# Altium schematic sheet [0X] - CPU POWER.SchDoc
size 817 x 513 mm
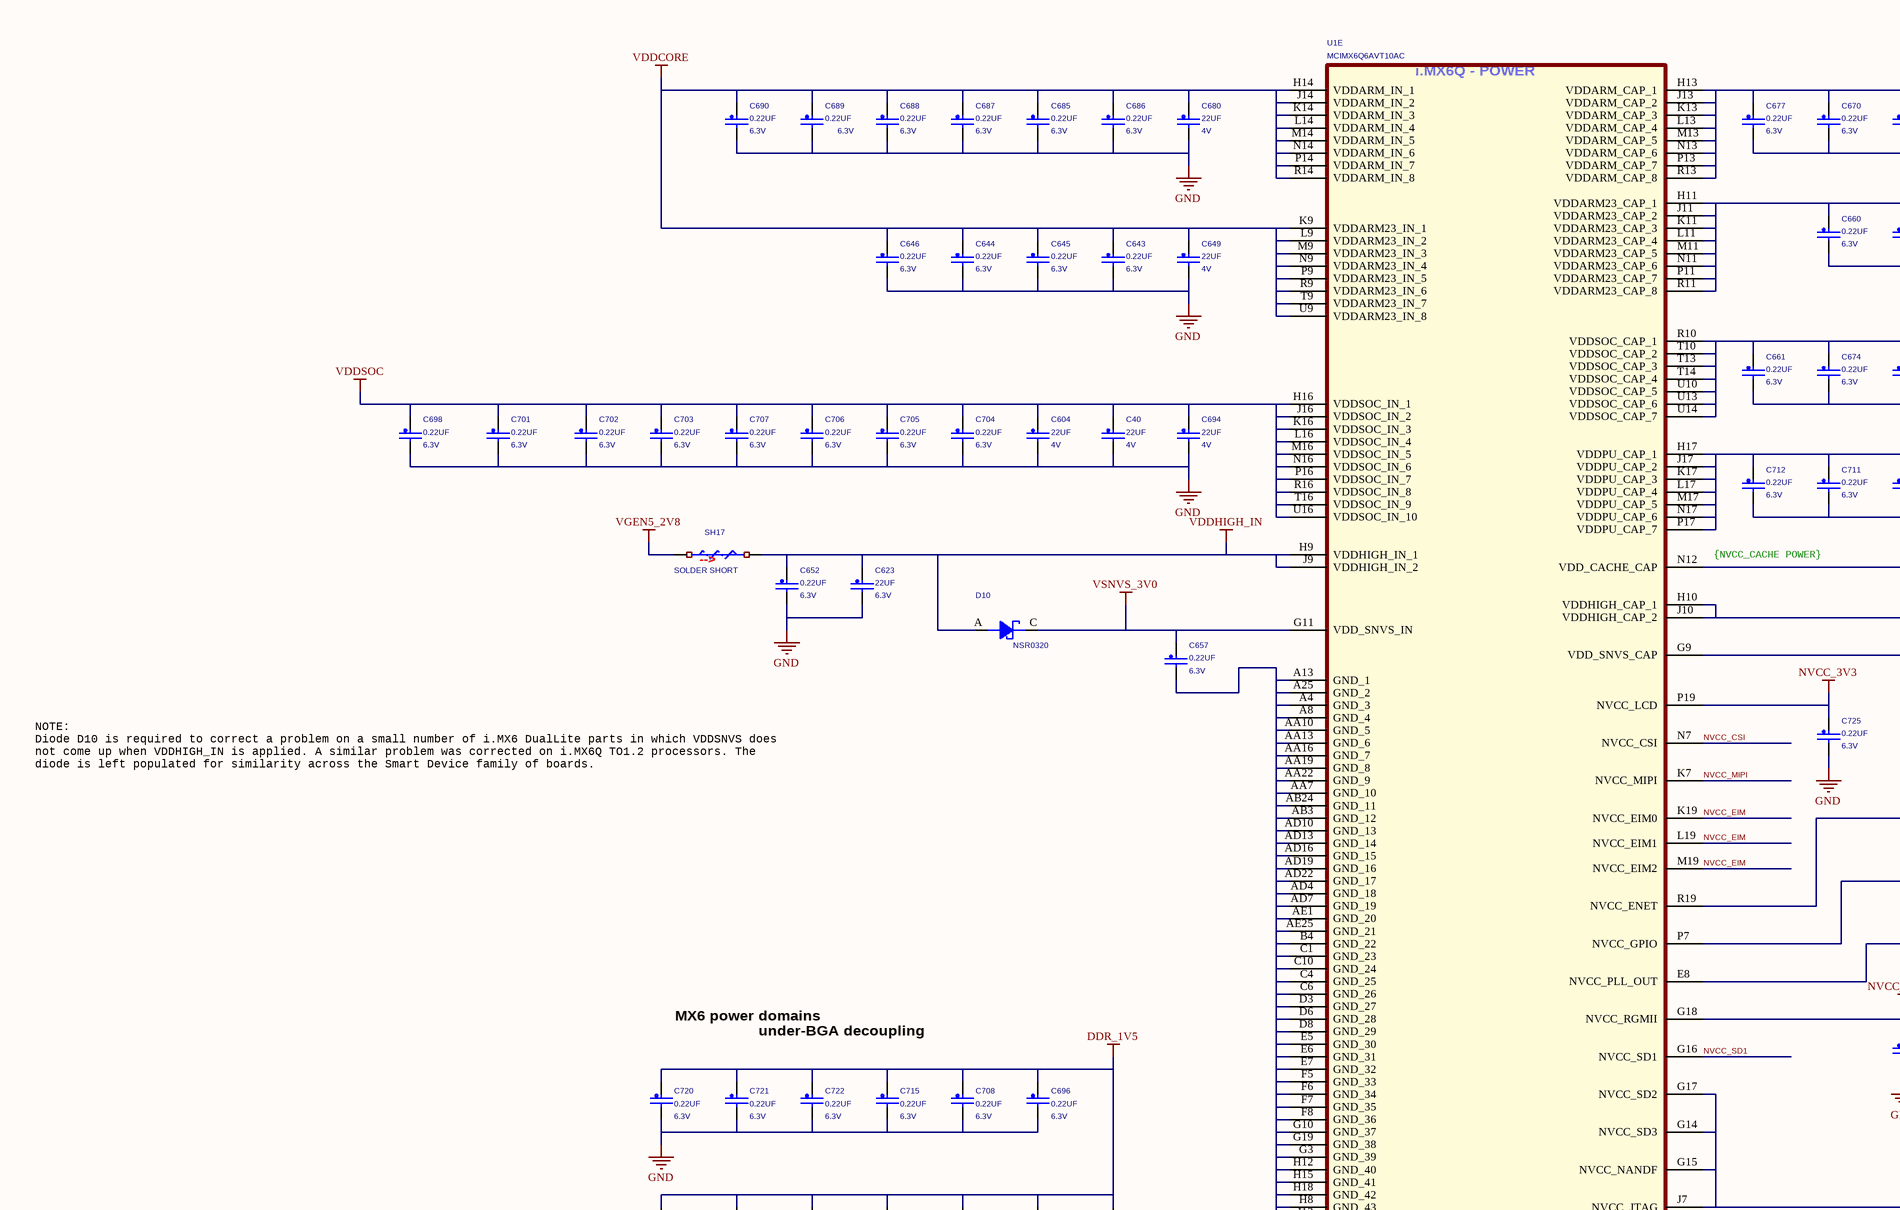
[diagram p0: [0X] - CPU POWER.SchDoc, top left]
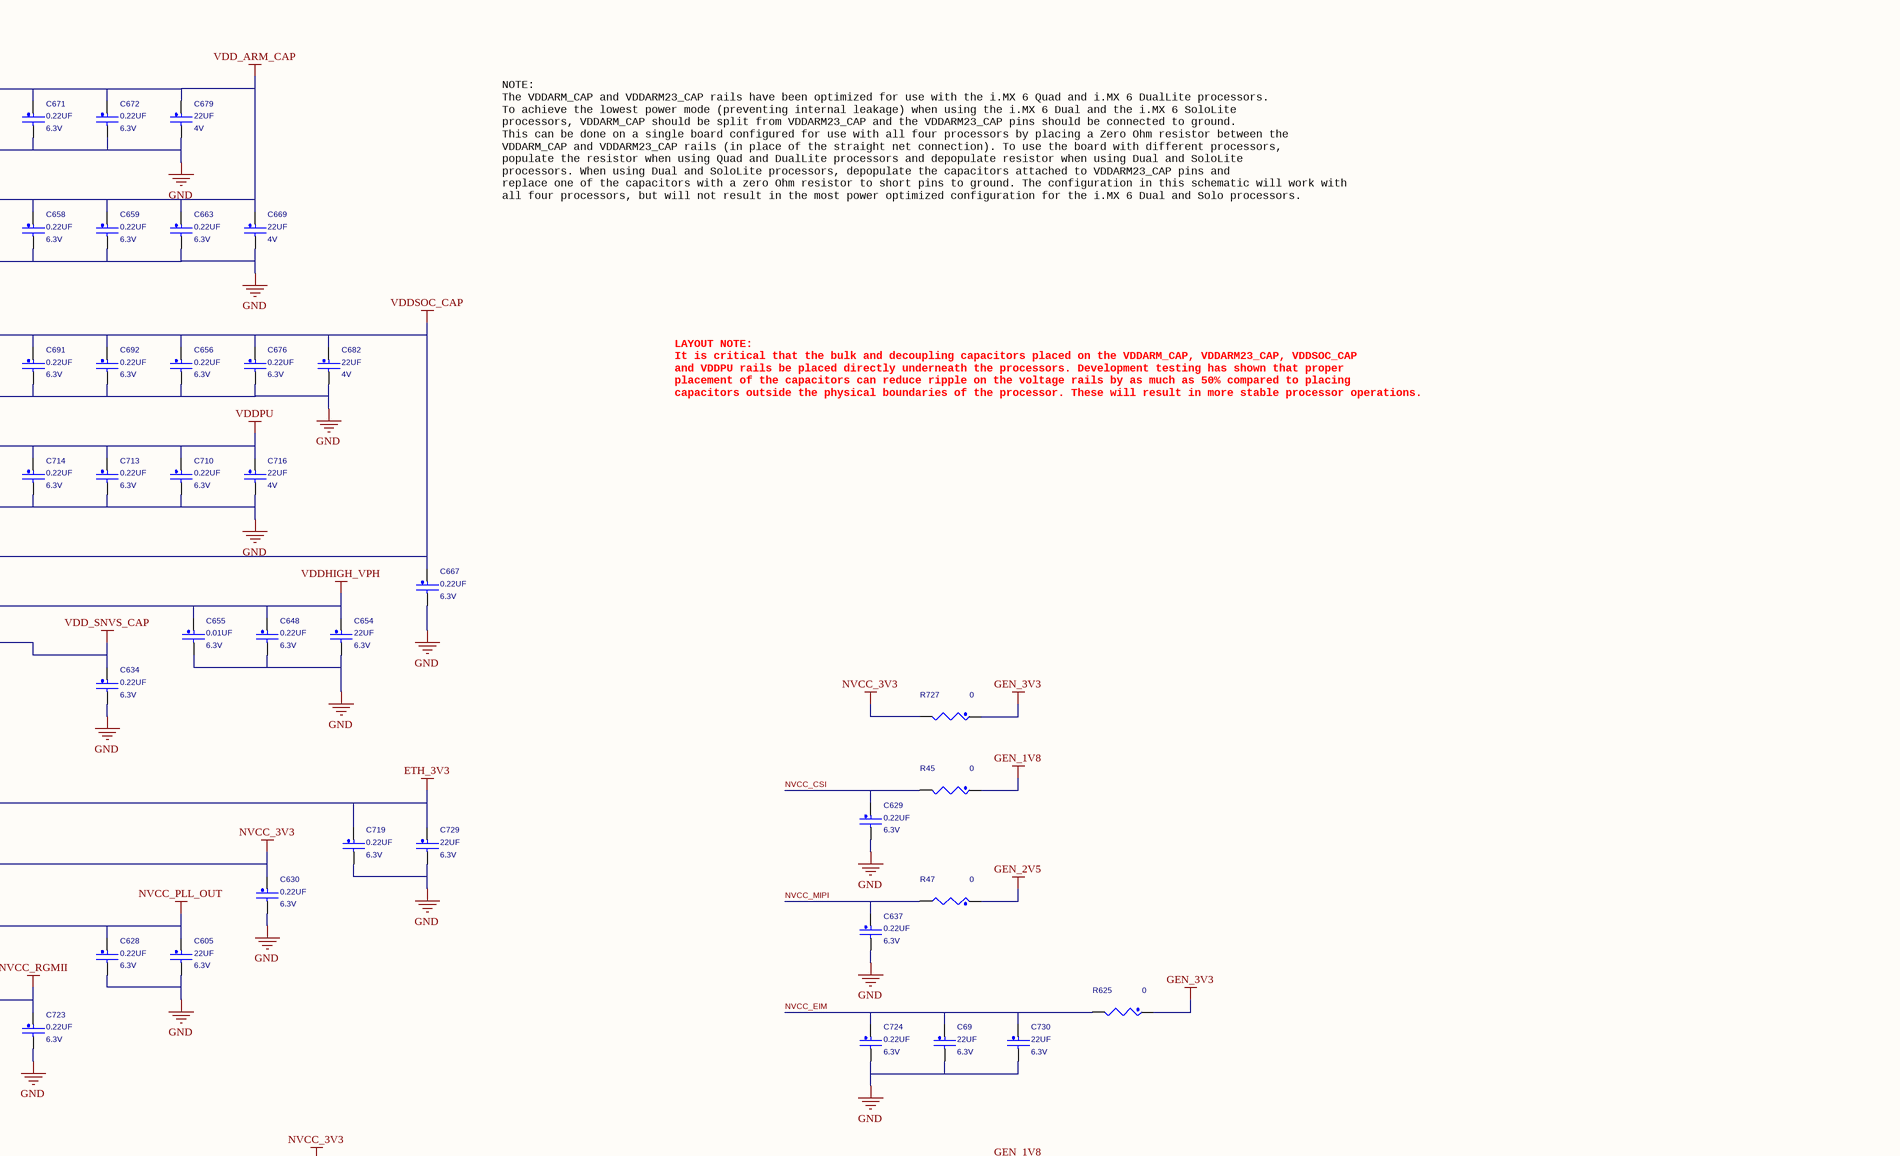
[diagram p1: [0X] - CPU POWER.SchDoc, top middle]
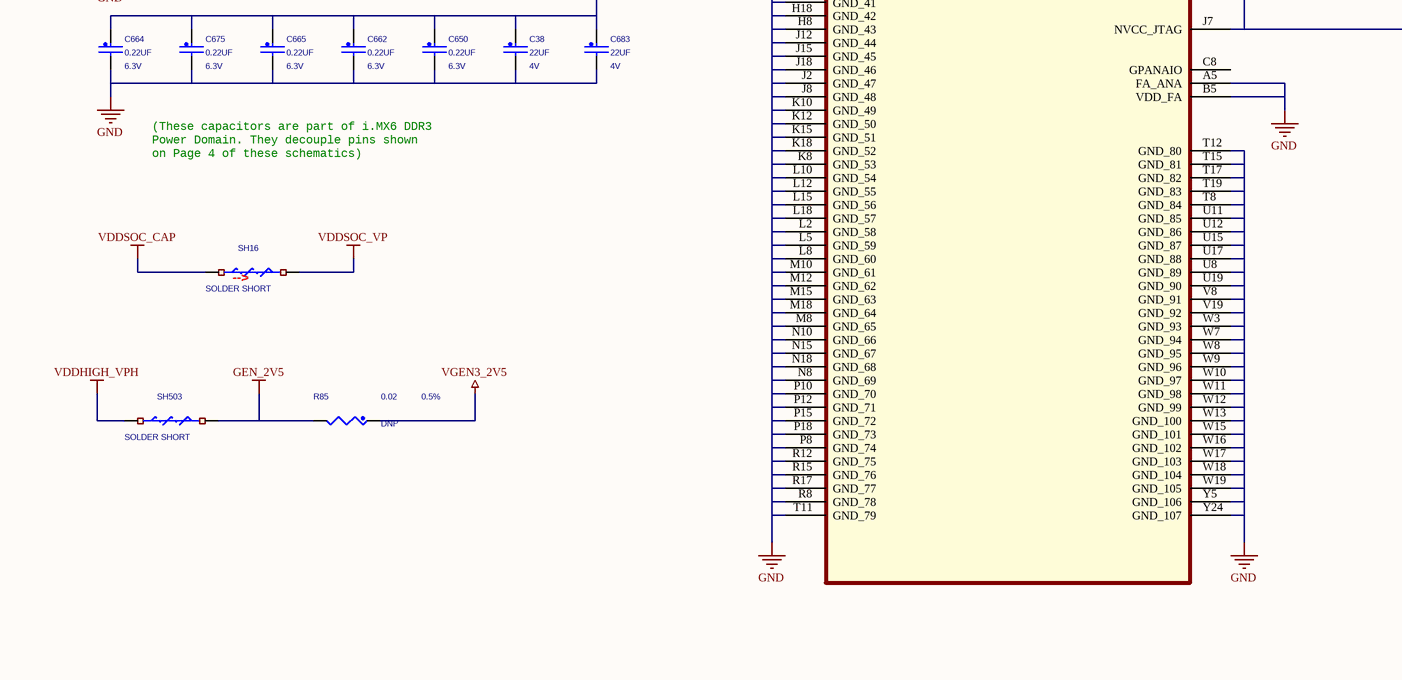
[diagram p2: [0X] - CPU POWER.SchDoc, bottom left]
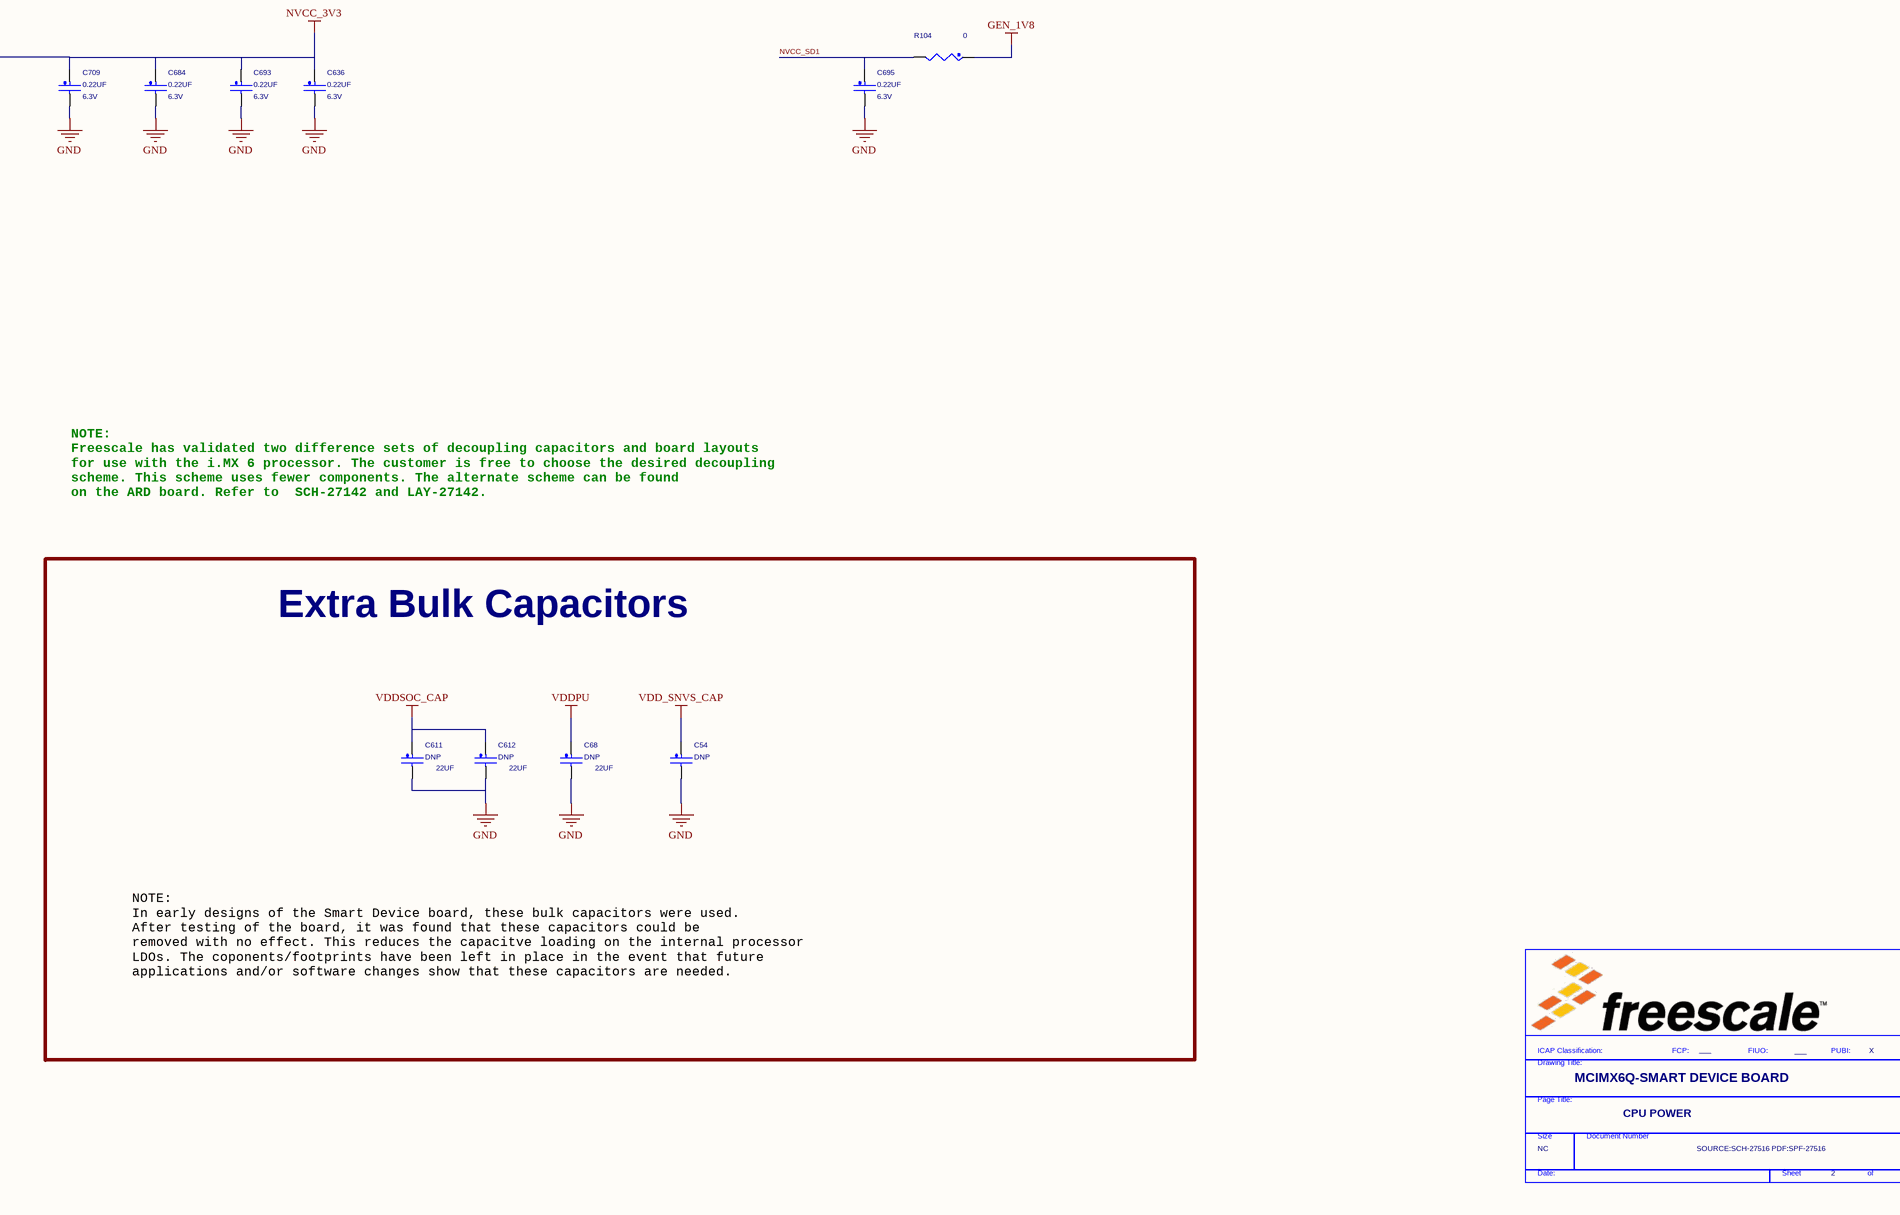
[diagram p3: [0X] - CPU POWER.SchDoc, bottom middle]
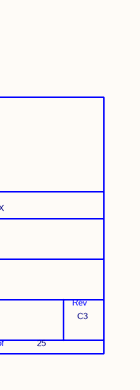
[diagram p4: [0X] - CPU POWER.SchDoc, bottom right]

## Parts
*  FIUO: ___  PUBI: X  Doc: SOURCE:SCH-27516 PDF:SPF-27516  RevCode: C3  Title: MCIMX6Q-SMART DEVICE BOARD  Page Size: NC  Page Number: 2  Page Count: 25  PageTitle: CPU POWER  (hidden comment: TitleBlock_FS)  (graphical)
C38  22UF  WVDC: 4V  [0603_CC]
C40  22UF  WVDC: 4V  [0603_CC]
C54  ASSY_OPT: DNP  [0603_CC]  (hidden comment: 22UF)
C68  22UF  ASSY_OPT: DNP  [0603_CC]
C69  22UF  WVDC: 6.3V  [0603_CC]
C604  22UF  WVDC: 4V  [0603_CC]
C605  22UF  WVDC: 6.3V  [0603_CC]
C611  22UF  ASSY_OPT: DNP  [0603_CC]
C612  22UF  ASSY_OPT: DNP  [0603_CC]
C623  22UF  WVDC: 6.3V  [0603_CC]
C628  0.22UF  WVDC: 6.3V  [0201_CC]
C629  0.22UF  WVDC: 6.3V  [0201_CC]
C630  0.22UF  WVDC: 6.3V  [0201_CC]
C634  0.22UF  WVDC: 6.3V  [0201_CC]
C636  0.22UF  WVDC: 6.3V  [0201_CC]
C637  0.22UF  WVDC: 6.3V  [0201_CC]
C643  0.22UF  WVDC: 6.3V  [0201_CC]
C644  0.22UF  WVDC: 6.3V  [0201_CC]
C645  0.22UF  WVDC: 6.3V  [0201_CC]
C646  0.22UF  WVDC: 6.3V  [0201_CC]
C648  0.22UF  WVDC: 6.3V  [0201_CC]
C649  22UF  WVDC: 4V  [0603_CC]
C650  0.22UF  WVDC: 6.3V  [0201_CC]
C652  0.22UF  WVDC: 6.3V  [0201_CC]
C654  22UF  WVDC: 6.3V  [0603_CC]
C655  0.01UF  WVDC: 6.3V  [0201_CC]
C656  0.22UF  WVDC: 6.3V  [0201_CC]
C657  0.22UF  WVDC: 6.3V  [0201_CC]
C658  0.22UF  WVDC: 6.3V  [0201_CC]
C659  0.22UF  WVDC: 6.3V  [0201_CC]
C660  0.22UF  WVDC: 6.3V  [0201_CC]
C661  0.22UF  WVDC: 6.3V  [0201_CC]
C662  0.22UF  WVDC: 6.3V  [0201_CC]
C663  0.22UF  WVDC: 6.3V  [0201_CC]
C664  0.22UF  WVDC: 6.3V  [0201_CC]
C665  0.22UF  WVDC: 6.3V  [0201_CC]
C667  0.22UF  WVDC: 6.3V  [0201_CC]
C669  22UF  WVDC: 4V  [0603_CC]
C670  0.22UF  WVDC: 6.3V  [0201_CC]
C671  0.22UF  WVDC: 6.3V  [0201_CC]
C672  0.22UF  WVDC: 6.3V  [0201_CC]
C674  0.22UF  WVDC: 6.3V  [0201_CC]
C675  0.22UF  WVDC: 6.3V  [0201_CC]
C676  0.22UF  WVDC: 6.3V  [0201_CC]
C677  0.22UF  WVDC: 6.3V  [0201_CC]
C679  22UF  WVDC: 4V  [0603_CC]
C680  22UF  WVDC: 4V  [0603_CC]
C682  22UF  WVDC: 4V  [0603_CC]
C683  22UF  WVDC: 4V  [0603_CC]
C684  0.22UF  WVDC: 6.3V  [0201_CC]
C685  0.22UF  WVDC: 6.3V  [0201_CC]
C686  0.22UF  WVDC: 6.3V  [0201_CC]
C687  0.22UF  WVDC: 6.3V  [0201_CC]
C688  0.22UF  WVDC: 6.3V  [0201_CC]
C689  0.22UF  WVDC: 6.3V  [0201_CC]
C690  0.22UF  WVDC: 6.3V  [0201_CC]
C691  0.22UF  WVDC: 6.3V  [0201_CC]
C692  0.22UF  WVDC: 6.3V  [0201_CC]
C693  0.22UF  WVDC: 6.3V  [0201_CC]
C694  22UF  WVDC: 4V  [0603_CC]
C695  0.22UF  WVDC: 6.3V  [0201_CC]
C696  0.22UF  WVDC: 6.3V  [0201_CC]
C698  0.22UF  WVDC: 6.3V  [0201_CC]
C701  0.22UF  WVDC: 6.3V  [0201_CC]
C702  0.22UF  WVDC: 6.3V  [0201_CC]
C703  0.22UF  WVDC: 6.3V  [0201_CC]
C704  0.22UF  WVDC: 6.3V  [0201_CC]
C705  0.22UF  WVDC: 6.3V  [0201_CC]
C706  0.22UF  WVDC: 6.3V  [0201_CC]
C707  0.22UF  WVDC: 6.3V  [0201_CC]
C708  0.22UF  WVDC: 6.3V  [0201_CC]
C709  0.22UF  WVDC: 6.3V  [0201_CC]
C710  0.22UF  WVDC: 6.3V  [0201_CC]
C711  0.22UF  WVDC: 6.3V  [0201_CC]
C712  0.22UF  WVDC: 6.3V  [0201_CC]
C713  0.22UF  WVDC: 6.3V  [0201_CC]
C714  0.22UF  WVDC: 6.3V  [0201_CC]
C715  0.22UF  WVDC: 6.3V  [0201_CC]
C716  22UF  WVDC: 4V  [0603_CC]
C719  0.22UF  WVDC: 6.3V  [0201_CC]
C720  0.22UF  WVDC: 6.3V  [0201_CC]
C721  0.22UF  WVDC: 6.3V  [0201_CC]
C722  0.22UF  WVDC: 6.3V  [0201_CC]
C723  0.22UF  WVDC: 6.3V  [0201_CC]
C724  0.22UF  WVDC: 6.3V  [0201_CC]
C725  0.22UF  WVDC: 6.3V  [0201_CC]
C729  22UF  WVDC: 6.3V  [0603_CC]
C730  22UF  WVDC: 6.3V  [0603_CC]
D10  NSR0320  [SOD323]
R45  0  [0402_CC]
R47  0  [0402_CC]
R85  0.02  Tolerance: 0.5%  ASSY_OPT: DNP  [0805_CC]
R104  0  [0402_CC]
R625  0  [0402_CC]
R727  0  [0402_CC]
SH16  SOLDER SHORT  [SH0805_40]
SH17  SOLDER SHORT  [SH0805_40]
SH503  SOLDER SHORT  [SH0805_40]
U1  MCIMX6Q6AVT10AC  [BGA624_0P8_21X21]  (part E of 12)

## Blocks framed on the sheet
Extra Bulk Capacitors: C54 C68 C611 C612

## Nets
DDR_1V5: C38.1 C650.1 C662.1 C664.1 C665.1 C675.1 C683.1 C696.1 C708.1 C715.1 C720.1 C721.1 C722.1
ETH_3V3: C719.1 C729.1 U1.R19(NVCC_ENET)
GEN_1V8: R45.1 R104.1
GEN_2V5: R47.1 R85.2 SH503.2
GEN_3V3: R625.1 R727.1
GND: C38.2 C40.2 C54.2 C68.2 C69.2 C604.2 C605.2 C611.2 C612.2 C623.2 C628.2 C629.2 C630.2 C634.2 C636.2 C637.2 C643.2 C644.2 C645.2 C646.2 C648.2 C649.2 C650.2 C652.2 C654.2 C655.2 C656.2 C657.2 C658.2 C659.2 C660.2 C661.2 C662.2 C663.2 C664.2 C665.2 C667.2 C669.2 C670.2 C671.2 C672.2 C674.2 C675.2 C676.2 C677.2 C679.2 C680.2 C682.2 C683.2 C684.2 C685.2 C686.2 C687.2 C688.2 C689.2 C690.2 C691.2 C692.2 C693.2 C694.2 C695.2 C696.2 C698.2 C701.2 C702.2 C703.2 C704.2 C705.2 C706.2 C707.2 C708.2 C709.2 C710.2 C711.2 C712.2 C713.2 C714.2 C715.2 C716.2 C719.2 C720.2 C721.2 C722.2 C723.2 C724.2 C725.2 C729.2 C730.2 U1.A4(GND_3) U1.A5(FA_ANA) U1.A8(GND_4) U1.A13(GND_1) U1.A25(GND_2) U1.AA7(GND_10) U1.AA10(GND_5) U1.AA13(GND_6) U1.AA16(GND_7) U1.AA19(GND_8) U1.AA22(GND_9) U1.AB3(GND_12) U1.AB24(GND_11) U1.AD4(GND_18) U1.AD7(GND_19) U1.AD10(GND_13) U1.AD13(GND_14) U1.AD16(GND_15) U1.AD19(GND_16) U1.AD22(GND_17) U1.AE1(GND_20) U1.AE25(GND_21) U1.B4(GND_22) U1.B5(VDD_FA) U1.C1(GND_23) U1.C4(GND_25) U1.C6(GND_26) U1.C10(GND_24) U1.D3(GND_27) U1.D6(GND_28) U1.D8(GND_29) U1.E5(GND_30) U1.E6(GND_31) U1.E7(GND_32) U1.F5(GND_33) U1.F6(GND_34) U1.F7(GND_35) U1.F8(GND_36) U1.G3(GND_39) U1.G10(GND_37) U1.G19(GND_38) U1.H8(GND_43) U1.H12(GND_40) U1.H15(GND_41) U1.H18(GND_42) U1.J2(GND_47) U1.J8(GND_48) U1.J12(GND_44) U1.J15(GND_45) U1.J18(GND_46) U1.K8(GND_53) U1.K10(GND_49) U1.K12(GND_50) U1.K15(GND_51) U1.K18(GND_52) U1.L2(GND_58) U1.L5(GND_59) U1.L8(GND_60) U1.L10(GND_54) U1.L12(GND_55) U1.L15(GND_56) U1.L18(GND_57) U1.M8(GND_65) U1.M10(GND_61) U1.M12(GND_62) U1.M15(GND_63) U1.M18(GND_64) U1.N8(GND_69) U1.N10(GND_66) U1.N15(GND_67) U1.N18(GND_68) U1.P8(GND_74) U1.P10(GND_70) U1.P12(GND_71) U1.P15(GND_72) U1.P18(GND_73) U1.R8(GND_78) U1.R12(GND_75) U1.R15(GND_76) U1.R17(GND_77) U1.T8(GND_84) U1.T11(GND_79) U1.T12(GND_80) U1.T15(GND_81) U1.T17(GND_82) U1.T19(GND_83) U1.U8(GND_89) U1.U11(GND_85) U1.U12(GND_86) U1.U15(GND_87) U1.U17(GND_88) U1.U19(GND_90) U1.V8(GND_91) U1.V19(GND_92) U1.W3(GND_93) U1.W7(GND_94) U1.W8(GND_95) U1.W9(GND_96) U1.W10(GND_97) U1.W11(GND_98) U1.W12(GND_99) U1.W13(GND_100) U1.W15(GND_101) U1.W16(GND_102) U1.W17(GND_103) U1.W18(GND_104) U1.W19(GND_105) U1.Y5(GND_106) U1.Y24(GND_107)
NVCC_3V3: C630.1 C636.1 C684.1 C693.1 C709.1 C725.1 R727.2 U1.G14(NVCC_SD3) U1.G15(NVCC_NANDF) U1.G17(NVCC_SD2) U1.J7(NVCC_JTAG) U1.P7(NVCC_GPIO) U1.P19(NVCC_LCD)
NVCC_PLL_OUT: C605.1 C628.1 U1.E8(NVCC_PLL_OUT)
NVCC_RGMII: C723.1 U1.G18(NVCC_RGMII)
VDD_ARM_CAP: C658.1 C659.1 C660.1 C663.1 C669.1 C670.1 C671.1 C672.1 C677.1 C679.1 U1.H11(VDDARM23_CAP_1) U1.H13(VDDARM_CAP_1) U1.J11(VDDARM23_CAP_2) U1.J13(VDDARM_CAP_2) U1.K11(VDDARM23_CAP_3) U1.K13(VDDARM_CAP_3) U1.L11(VDDARM23_CAP_4) U1.L13(VDDARM_CAP_4) U1.M11(VDDARM23_CAP_5) U1.M13(VDDARM_CAP_5) U1.N11(VDDARM23_CAP_6) U1.N13(VDDARM_CAP_6) U1.P11(VDDARM23_CAP_7) U1.P13(VDDARM_CAP_7) U1.R11(VDDARM23_CAP_8) U1.R13(VDDARM_CAP_8)
VDD_SNVS_CAP: C54.1 C634.1 U1.G9(VDD_SNVS_CAP)
VDDCORE: C643.1 C644.1 C645.1 C646.1 C649.1 C680.1 C685.1 C686.1 C687.1 C688.1 C689.1 C690.1 U1.H14(VDDARM_IN_1) U1.J14(VDDARM_IN_2) U1.K9(VDDARM23_IN_1) U1.K14(VDDARM_IN_3) U1.L9(VDDARM23_IN_2) U1.L14(VDDARM_IN_4) U1.M9(VDDARM23_IN_3) U1.M14(VDDARM_IN_5) U1.N9(VDDARM23_IN_4) U1.N14(VDDARM_IN_6) U1.P9(VDDARM23_IN_5) U1.P14(VDDARM_IN_7) U1.R9(VDDARM23_IN_6) U1.R14(VDDARM_IN_8) U1.T9(VDDARM23_IN_7) U1.U9(VDDARM23_IN_8)
VDDHIGH_IN: C623.1 C652.1 D10.A SH17.2 U1.H9(VDDHIGH_IN_1) U1.J9(VDDHIGH_IN_2)
VDDHIGH_VPH: C648.1 C654.1 C655.1 SH503.1 U1.H10(VDDHIGH_CAP_1) U1.J10(VDDHIGH_CAP_2)
VDDPU: C68.1 C710.1 C711.1 C712.1 C713.1 C714.1 C716.1 U1.H17(VDDPU_CAP_1) U1.J17(VDDPU_CAP_2) U1.K17(VDDPU_CAP_3) U1.L17(VDDPU_CAP_4) U1.M17(VDDPU_CAP_5) U1.N17(VDDPU_CAP_6) U1.P17(VDDPU_CAP_7)
VDDSOC: C40.1 C604.1 C694.1 C698.1 C701.1 C702.1 C703.1 C704.1 C705.1 C706.1 C707.1 U1.H16(VDDSOC_IN_1) U1.J16(VDDSOC_IN_2) U1.K16(VDDSOC_IN_3) U1.L16(VDDSOC_IN_4) U1.M16(VDDSOC_IN_5) U1.N16(VDDSOC_IN_6) U1.P16(VDDSOC_IN_7) U1.R16(VDDSOC_IN_8) U1.T16(VDDSOC_IN_9) U1.U16(VDDSOC_IN_10)
VDDSOC_CAP: C611.1 C612.1 C656.1 C661.1 C667.1 C674.1 C676.1 C682.1 C691.1 C692.1 SH16.1 U1.N12(VDD_CACHE_CAP) U1.R10(VDDSOC_CAP_1) U1.T10(VDDSOC_CAP_2) U1.T13(VDDSOC_CAP_3) U1.T14(VDDSOC_CAP_4) U1.U10(VDDSOC_CAP_5) U1.U13(VDDSOC_CAP_6) U1.U14(VDDSOC_CAP_7)
VDDSOC_VP: SH16.2
VGEN3_2V5: R85.1
VGEN5_2V8: SH17.1
VSNVS_3V0: C657.1 D10.C U1.G11(VDD_SNVS_IN)
NVCC_CSI: C629.1 R45.2 U1.N7(NVCC_CSI)
NVCC_EIM: C69.1 C724.1 C730.1 R625.2 U1.K19(NVCC_EIM0) U1.L19(NVCC_EIM1) U1.M19(NVCC_EIM2)
NVCC_MIPI: C637.1 R47.2 U1.K7(NVCC_MIPI)
NVCC_SD1: C695.1 R104.2 U1.G16(NVCC_SD1)

Not connected (* = marked no-connect by the designer): U1 C8(GPANAIO)

## Notes on the sheet
- NOTE:
  The VDDARM_CAP and VDDARM23_CAP rails have been optimized for use with the i.MX 6 Quad and i.MX 6 DualLite processors.
  To achieve the lowest power mode (preventing internal leakage) when using the i.MX 6 Dual and the i.MX 6 SoloLite
  processors, VDDARM_CAP should be split from VDDARM23_CAP and the VDDARM23_CAP pins should be connected to ground.
  This can be done on a single board configured for use with all four processors by placing a Zero Ohm resistor between the
  VDDARM_CAP and VDDARM23_CAP rails (in place of the straight net connection). To use the board with different processors,
  populate the resistor when using Quad and DualLite processors and depopulate resistor when using Dual and SoloLite
  processors. When using Dual and SoloLite processors, depopulate the capacitors attached to VDDARM23_CAP pins and
  replace one of the capacitors with a zero Ohm resistor to short pins to ground. The configuration in this schematic will work with
  all four processors, but will not result in the most power optimized configuration for the i.MX 6 Dual and Solo processors.
- LAYOUT NOTE:
  It is critical that the bulk and decoupling capacitors placed on the VDDARM_CAP, VDDARM23_CAP, VDDSOC_CAP
  and VDDPU rails be placed directly underneath the processors. Development testing has shown that proper
  placement of the capacitors can reduce ripple on the voltage rails by as much as 50% compared to placing
  capacitors outside the physical boundaries of the processor. These will result in more stable processor operations.
- (near SH17) -->
- {NVCC_CACHE POWER}
- NOTE:
  Diode D10 is required to correct a problem on a small number of i.MX6 DualLite parts in which VDDSNVS does
  not come up when VDDHIGH_IN is applied. A similar problem was corrected on i.MX6Q TO1.2 processors. The
  diode is left populated for similarity across the Smart Device family of boards.
- MX6 power domains
  under-BGA decoupling
- (These capacitors are part of i.MX6 DDR3
  Power Domain. They decouple pins shown
  on Page 4 of these schematics)
- (near SH16) -->
- NOTE:
  Freescale has validated two difference sets of decoupling capacitors and board layouts
  for use with the i.MX 6 processor. The customer is free to choose the desired decoupling
  scheme. This scheme uses fewer components. The alternate scheme can be found
  on the ARD board. Refer to  SCH-27142 and LAY-27142.
- NOTE:
  In early designs of the Smart Device board, these bulk capacitors were used.
  After testing of the board, it was found that these capacitors could be
  removed with no effect. This reduces the capacitve loading on the internal processor
  LDOs. The coponents/footprints have been left in place in the event that future
  applications and/or software changes show that these capacitors are needed.
- (in symbol PCIMX6Q6VV1A, part E) i.MX6Q - POWER
- (in symbol TitleBlock_FS) ICAP Classification:; FCP:; FIUO:; PUBI:; Drawing Title:; Page Title:; Size; Document Number; Rev; Date:; Sheet; of

## Library data of the parts
* = TitleBlock_FS: OrgAddr2: Austin, TX 78735-8598; OrgAddr1: 6501 William Cannon Drive West; OrgName: Freescale Semiconductor; FCP: ___; Page Create Date: March  8, 1995
C38 C604 C605 = CAP_NP: CAP CER 22UF 4V 20% X5R 0603; CLASS: DISCRETE; VOLTAGE: 4.0V; SIGNAL_MODEL: DEFAULT_CAPACITOR_2.2e+07pF_2_1; PRIORITY_PN: 021-00276; FPLIST: CC0603_OV,CC0603,0603_CC; CAD_APPROVED: Yes; MFG_PN01: AMK107BJ226MA-T; MFG_NAME01: TAIYO YUDEN; AGILE_PN: 150-77974; HEIGHT: 0.9MM; ROHS: Yes; Tolerance: 20%
C40 C649 C682 C694 = CAP_NP: CAP CER 22UF 4V 20% X5R 0603; CLASS: DISCRETE; VOLTAGE: 4.0V; SIGNAL_MODEL: DEFAULT_CAPACITOR_2.2e+07pF_2_1; AGILE_PN: 150-77974; MFG_NAME01: TAIYO YUDEN; MFG_PN01: AMK107BJ226MA-T; CAD_APPROVED: Yes; FPLIST: CC0603_OV,CC0603,0603_CC; Tolerance: 20%; ROHS: Yes; HEIGHT: 0.9MM
C54 = CAP_NP: CAP CER 22UF 4V 20% X5R 0603; CLASS: DISCRETE; SIGNAL_MODEL: DEFAULT_CAPACITOR_2.2e+07pF_2_1; WVDC: 6.3V; PRIORITY_PN: 021-00276; FPLIST: CC0603_OV,CC0603,0603_CC; CAD_APPROVED: Yes; MFG_PN01: AMK107BJ226MA-T; MFG_NAME01: TAIYO YUDEN; AGILE_PN: 150-77974; VOLTAGE: 4.0V; HEIGHT: 0.9MM; ROHS: Yes; Tolerance: 20%
C68 = CAP_NP: CAP CER 22UF 4V 20% X5R 0603; CLASS: DISCRETE; VOLTAGE: 4.0V; AGILE_PN: 150-77974; MFG_NAME01: TAIYO YUDEN; MFG_PN01: AMK107BJ226MA-T; CAD_APPROVED: Yes; FPLIST: CC0603_OV,CC0603,0603_CC; SIGNAL_MODEL: DEFAULT_CAPACITOR_2.2e+07pF_2_1; Tolerance: 20%; ROHS: Yes; HEIGHT: 0.9MM; WVDC: 4V
C69 C623 C730 = CAP_NP: CAP CER 22UF 6.3V 20% X5R 0603; CLASS: DISCRETE; AGILE_PN: 150-78467; MFG_NAME01: Samsung; MFG_PN01: CL10A226MQ8NRNE; CAD_APPROVED: Yes; FPLIST: CC0603_OV,CC0603,0603_CC; PRIORITY_PN: 021-00276; SIGNAL_MODEL: DEFAULT_CAPACITOR_2.2e+07pF_2_1; VOLTAGE: 6.3V; Tolerance: 20%; ROHS: Yes; HEIGHT: 1MM
C611 = CAP_NP: CAP CER 22UF 4V 20% X5R 0603; CLASS: DISCRETE; SIGNAL_MODEL: DEFAULT_CAPACITOR_2.2e+07pF_2_1; FPLIST: CC0603_OV,CC0603,0603_CC; CAD_APPROVED: Yes; MFG_PN01: AMK107BJ226MA-T; MFG_NAME01: TAIYO YUDEN; AGILE_PN: 150-77974; VOLTAGE: 4.0V; WVDC: 4V; HEIGHT: 0.9MM; ROHS: Yes; Tolerance: 20%
C612 C669 = CAP_NP: CAP CER 22UF 4V 20% X5R 0603; CLASS: DISCRETE; VOLTAGE: 4.0V; FPLIST: CC0603_OV,CC0603,0603_CC; CAD_APPROVED: Yes; MFG_PN01: AMK107BJ226MA-T; MFG_NAME01: TAIYO YUDEN; AGILE_PN: 150-77974; SIGNAL_MODEL: DEFAULT_CAPACITOR_2.2e+07pF_2_1; HEIGHT: 0.9MM; ROHS: Yes; Tolerance: 20%
  C612: WVDC: 4V
C628 C630 C684 C695 C725 = CAP_NP: CAP CER 0.22UF 6.3V 20% X5R 0201; CLASS: DISCRETE; SIGNAL_MODEL: DEFAULT_CAPACITOR_220000pF_2_1; ROOM: CPU; AGILE_PN: 150-77852; MFG_NAME01: TAIYO YUDEN; MFG_PN01: JMK063BJ224MP-F; CAD_APPROVED: Yes; FPLIST: CC0201,CC0201_HD,0201_CC; PRIORITY_PN: 021-00278; VOLTAGE: 6.3V; Tolerance: 20%; ROHS: Yes; HEIGHT: 0.33 MM
C629 C636 C637 C648 C693 C709 C719 C723 C724 = CAP_NP: CAP CER 0.22UF 6.3V 20% X5R 0201; CLASS: DISCRETE; SIGNAL_MODEL: DEFAULT_CAPACITOR_220000pF_2_1; PRIORITY_PN: 021-00278; FPLIST: CC0201,CC0201_HD,0201_CC; CAD_APPROVED: Yes; MFG_PN01: JMK063BJ224MP-F; MFG_NAME01: TAIYO YUDEN; AGILE_PN: 150-77852; ROOM: CPU; VOLTAGE: 6.3V; HEIGHT: 0.33 MM; ROHS: Yes; Tolerance: 20%
C634 = CAP_NP: CAP CER 0.22UF 6.3V 20% X5R 0201; CLASS: DISCRETE; PRIORITY_PN: 021-00278; FPLIST: CC0201,CC0201_HD,0201_CC; CAD_APPROVED: Yes; MFG_PN01: JMK063BJ224MP-F; MFG_NAME01: TAIYO YUDEN; AGILE_PN: 150-77852; ROOM: CPU; SIGNAL_MODEL: DEFAULT_CAPACITOR_220000pF_2_1; VOLTAGE: 6.3V; HEIGHT: 0.33 MM; ROHS: Yes; Tolerance: 20%
C643 C652 C658 C670 C687-C690 C696 C702 C711 C712 C714 C715 = CAP_NP: CAP CER 0.22UF 6.3V 20% X5R 0201; CLASS: DISCRETE; SIGNAL_MODEL: DEFAULT_CAPACITOR_220000pF_2_1; ROOM: CPU; AGILE_PN: 150-77852; MFG_NAME01: TAIYO YUDEN; MFG_PN01: JMK063BJ224MP-F; CAD_APPROVED: Yes; FPLIST: CC0201,CC0201_HD,0201_CC,cc_0201_cir; PRIORITY_PN: 021-00278; VOLTAGE: 6.3V; Tolerance: 20%; ROHS: Yes; HEIGHT: 0.33 MM
C644-C646 C660 C664 C675 C677 C685 C686 C692 C698 C701 C708 C720-C722 = CAP_NP: CAP CER 0.22UF 6.3V 20% X5R 0201; CLASS: DISCRETE; SIGNAL_MODEL: DEFAULT_CAPACITOR_220000pF_2_1; PRIORITY_PN: 021-00278; FPLIST: CC0201,CC0201_HD,0201_CC,cc_0201_cir; CAD_APPROVED: Yes; MFG_PN01: JMK063BJ224MP-F; MFG_NAME01: TAIYO YUDEN; AGILE_PN: 150-77852; ROOM: CPU; VOLTAGE: 6.3V; HEIGHT: 0.33 MM; ROHS: Yes; Tolerance: 20%
C650 C662 C665 = CAP_NP: CAP CER 0.22UF 6.3V 20% X5R 0201; CLASS: DISCRETE; SIGNAL_MODEL: DEFAULT_CAPACITOR_220000pF_2_1; ROOM: CPU; AGILE_PN: 150-77852; MFG_NAME01: TAIYO YUDEN; MFG_PN01: JMK063BJ224MP-F; CAD_APPROVED: Yes; FPLIST: CC0201,CC0201_HD,0201_CC,cc_0201_cir; PRIORITY_PN: 021-00273; VOLTAGE: 6.3V; Tolerance: 20%; ROHS: Yes; HEIGHT: 0.33 MM
C654 C729 = CAP_NP: CAP CER 22UF 6.3V 20% X5R 0603; CLASS: DISCRETE; PRIORITY_PN: 021-00276; FPLIST: CC0603_OV,CC0603,0603_CC; CAD_APPROVED: Yes; MFG_PN01: CL10A226MQ8NRNE; MFG_NAME01: Samsung; AGILE_PN: 150-78467; SIGNAL_MODEL: DEFAULT_CAPACITOR_2.2e+07pF_2_1; VOLTAGE: 6.3V; HEIGHT: 1MM; ROHS: Yes; Tolerance: 20%
C655 = CAP_NP: CAP CER 0.01UF 6.3V 10% X7R 0201; CLASS: DISCRETE; SIGNAL_MODEL: DEFAULT_CAPACITOR_10000pF_2_1; PRIORITY_PN: 021-00273; FPLIST: CC0201,CC0201_HD,0201_CC,cc_0201_cir; CAD_APPROVED: YES; MFG_PN01: GRM033R70J103KA01D; MFG_NAME01: MURATA; AGILE_PN: 150-75465; ROOM: CPU; VOLTAGE: 6.3V; HEIGHT: 0.33 MM; ROHS: Yes; Tolerance: 10%
C656 C661 C674 C676 C691 C704-C707 C710 C713 = CAP_NP: CAP CER 0.22UF 6.3V 20% X5R 0201; CLASS: DISCRETE; SIGNAL_MODEL: DEFAULT_CAPACITOR_220000pF_2_1; ROOM: CPU; PRIORITY_PN: 021-00278; FPLIST: CC0201,CC0201_HD,0201_CC,cc_0201_cir; CAD_APPROVED: Yes; MFG_PN01: JMK063BJ224MP-F; MFG_NAME01: TAIYO YUDEN; AGILE_PN: 150-77852; VOLTAGE: 6.3V; HEIGHT: 0.33 MM; ROHS: Yes; Tolerance: 20%
C657 = CAP_NP: CAP CER 0.22UF 6.3V 20% X5R 0201; CLASS: DISCRETE; SIGNAL_MODEL: DEFAULT_CAPACITOR_220000pF_2_1; PRIORITY_PN: 021-00274; FPLIST: CC0201,CC0201_HD,0201_CC,cc_0201_cir; CAD_APPROVED: Yes; MFG_PN01: JMK063BJ224MP-F; MFG_NAME01: TAIYO YUDEN; AGILE_PN: 150-77852; VOLTAGE: 6.3V; HEIGHT: 0.33 MM; ROHS: Yes; Tolerance: 20%
C659 C663 C671 C672 C703 = CAP_NP: CAP CER 0.22UF 6.3V 20% X5R 0201; CLASS: DISCRETE; SIGNAL_MODEL: DEFAULT_CAPACITOR_220000pF_2_1; AGILE_PN: 150-77852; MFG_NAME01: TAIYO YUDEN; MFG_PN01: JMK063BJ224MP-F; CAD_APPROVED: Yes; FPLIST: CC0201,CC0201_HD,0201_CC,cc_0201_cir; PRIORITY_PN: 021-00278; ROOM: CPU; VOLTAGE: 6.3V; Tolerance: 20%; ROHS: Yes; HEIGHT: 0.33 MM
C667 = CAP_NP: CAP CER 0.22UF 6.3V 20% X5R 0201; CLASS: DISCRETE; ROOM: CPU; AGILE_PN: 150-77852; MFG_NAME01: TAIYO YUDEN; MFG_PN01: JMK063BJ224MP-F; CAD_APPROVED: Yes; FPLIST: CC0201,CC0201_HD,0201_CC,cc_0201_cir; PRIORITY_PN: 021-00278; SIGNAL_MODEL: DEFAULT_CAPACITOR_220000pF_2_1; VOLTAGE: 6.3V; Tolerance: 20%; ROHS: Yes; HEIGHT: 0.33 MM
C679 C680 C716 = CAP_NP: CAP CER 22UF 4V 20% X5R 0603; CLASS: DISCRETE; VOLTAGE: 4.0V; SIGNAL_MODEL: DEFAULT_CAPACITOR_2.2e+07pF_2_1; FPLIST: CC0603_OV,CC0603,0603_CC; CAD_APPROVED: Yes; MFG_PN01: AMK107BJ226MA-T; MFG_NAME01: TAIYO YUDEN; AGILE_PN: 150-77974; HEIGHT: 0.9MM; ROHS: Yes; Tolerance: 20%
C683 = CAP_NP: CAP CER 22UF 4V 20% X5R 0603; CLASS: DISCRETE; VOLTAGE: 4.0V; SIGNAL_MODEL: DEFAULT_CAPACITOR_2.2e+07pF_2_1; AGILE_PN: 150-77974; MFG_NAME01: TAIYO YUDEN; MFG_PN01: AMK107BJ226MA-T; CAD_APPROVED: Yes; FPLIST: CC0603_OV,CC0603,0603_CC; PRIORITY_PN: 021-00276; Tolerance: 20%; ROHS: Yes; HEIGHT: 0.9MM
D10 = DIODE_SCHTKY: DIODE SCH PWR RECT LOW VF 1A 20V SOD323; CLASS: IC; CAD_APPROVED: Yes; MFG_PN01: NSR0320MW2T1G; MFG_NAME01: ON Semiconductor; AGILE_PN: 480-77923; HEIGHT: 1.1MM; ROHS: Yes
R45 R104 = RES: RES MF ZERO OHM 1/10W -- 0402; CLASS: DISCRETE; SIGNAL_MODEL: DEFAULT_RESISTOR_0.001OHM_2_1; AGILE_PN: 470-79965; MFG_NAME01: Panasonic; MFG_PN01: ERJ-2GE0R00X; CAD_APPROVED: Yes; FPLIST: RC0402_25,RC0402_HD,RC0402_X2,0402_CC; ROHS: Yes
R47 = RES: RES MF ZERO OHM 1/10W -- 0402; CLASS: DISCRETE; SIGNAL_MODEL: DEFAULT_RESISTOR_0.001OHM_2_1; AGILE_PN: 470-79965; MFG_NAME01: Panasonic; MFG_PN01: ERJ-2GE0R00X; CAD_APPROVED: Yes; FPLIST: RC0402_25,RC0402_HD,RC0402_X2,0402_CC; PRIORITY_PN: 006-00371; ROHS: Yes
R85 = RES: RES MF 0.02OHM 1/4W 0.5% 0805; CLASS: DISCRETE; AGILE_PN: 470-79241; MFG_NAME01: VISHAY INTERTECHNOLOGY; MFG_PN01: WSL0805R0200DEA18; CAD_APPROVED: Yes; FPLIST: RC0805_OV,RC0805,0805_CC; PRIORITY_PN: 006-00742; SIGNAL_MODEL: DEFAULT_RESISTOR_0.02OHM_2_1; ROHS: Yes
R625 = RES: RES MF ZERO OHM 1/10W -- 0402; CLASS: DISCRETE; SIGNAL_MODEL: DEFAULT_RESISTOR_0.001OHM_2_1; FPLIST: RC0402_25,RC0402_HD,RC0402_X2,0402_CC; CAD_APPROVED: Yes; MFG_PN01: ERJ-2GE0R00X; MFG_NAME01: Panasonic; AGILE_PN: 470-79965; ROHS: Yes
R727 = RES: RES MF ZERO OHM 1/10W -- 0402; CLASS: DISCRETE; AGILE_PN: 470-79965; MFG_NAME01: Panasonic; MFG_PN01: ERJ-2GE0R00X; CAD_APPROVED: Yes; FPLIST: RC0402_25,RC0402_HD,RC0402_X2,0402_CC; SIGNAL_MODEL: DEFAULT_RESISTOR_0.001OHM_2_1; ROHS: Yes
SH16 SH17 SH503 = RES_SHORT-2: SOLDER SHORT 0805  SMT NO PART TO ORDER; CLASS: DISCRETE; FPLIST: SH0805,SH0805CUST,SH0805_40; CAD_APPROVED: Yes; ASSY_OPT: DNP; MFG_PN01: SOLDER_SHORT_0805; MFG_NAME01: NOTACOMPONENT; AGILE_PN: 470-80202; ROHS: Yes
U1 = PCIMX6Q6VV1A: IC MCU MX6QUAD ARM CORTEX-A9 FCPBGA624; CAD_APPROVED: Yes; MFG_NAME01: FREESCALE SEMICONDUCTOR; AGILE_PN: 344-01218; CLASS: IC; HEIGHT: 2.16MM; ROHS: Yes; MFG_PN01: MCIMX6Q6AVT10AC